# EAGLE design rapidshark-half-assed-half-h-bridge-mk-1.1 (EAGLE 7.5.0)
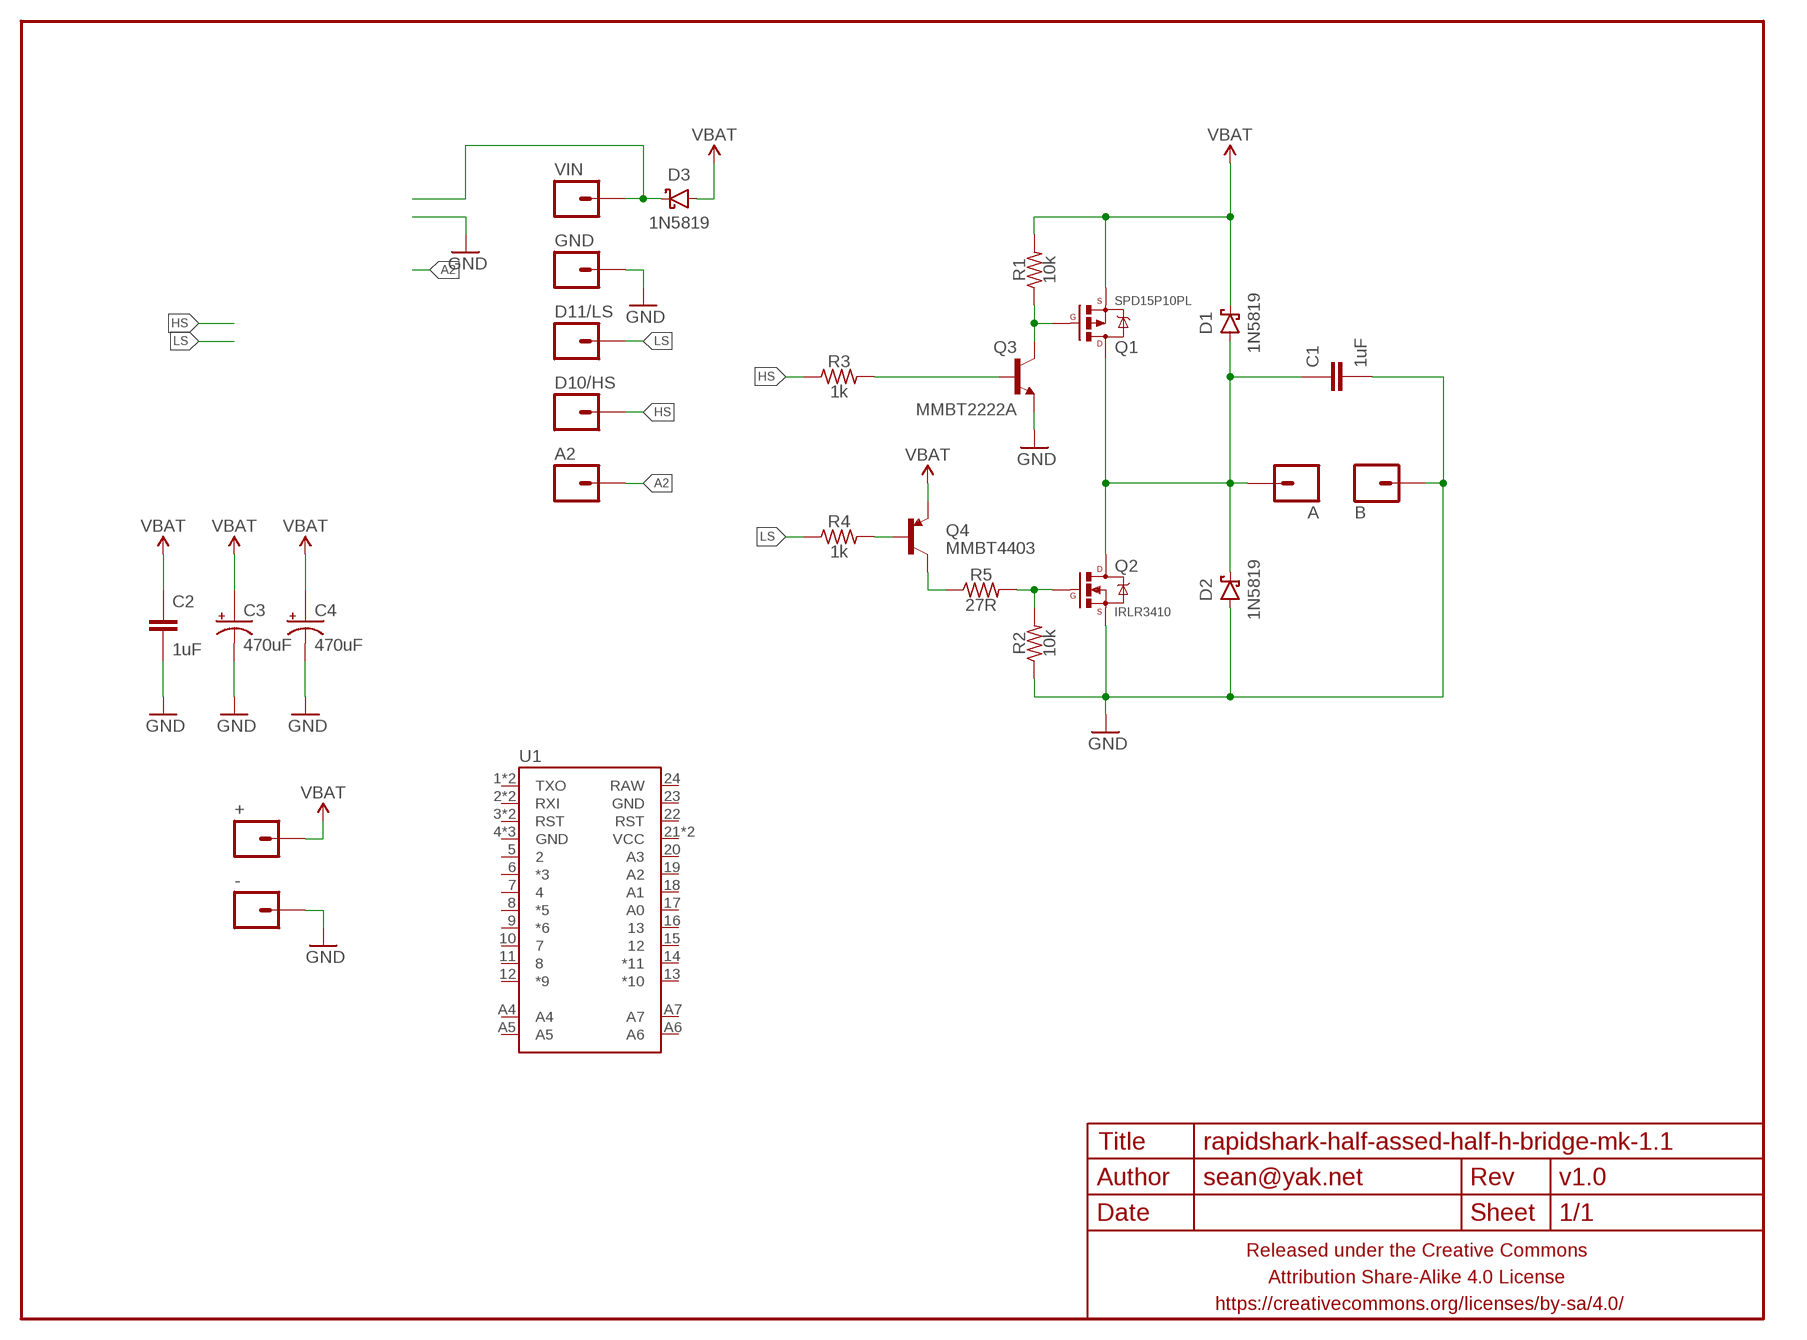
[diagram p0: schematic, sheet 1]

## Parts
+  M01PTH-1.4MM  [1X01-1.4MM-CIR]
-  M01PTH-1.4MM  [1X01-1.4MM-CIR]
A  M01PTH-1.4MM  [1X01-1.4MM-CIR]
A2  M01PTH  [1X01]
B  M01PTH-1.4MM  [1X01-1.4MM-CIR]
C1  1uF  CAPACITOR-CERAMICC0603-TIGHTER  [C0603-TIGHTER]
C2  1uF  CAPACITOR-CERAMICC0603-TIGHTER  [C0603-TIGHTER]
C3  470uF  CAPACITOR-POLARIZEDE5-10.5  [E5-10,5]
C4  470uF  CAPACITOR-POLARIZEDE5-10.5  [E5-10,5]
D1  1N5819  DIODE-SCHOTTKYSMA  [SMA-DIODE-SCHOTTKY]
D2  1N5819  DIODE-SCHOTTKYSMA  [SMA-DIODE-SCHOTTKY]
D3  1N5819  DIODE-SCHOTTKYSOD323  [SOD323-SCHOTTKY]
D10/HS  M01PTH  [1X01]
D11/LS  M01PTH  [1X01]
FRAME1  FRAME-LETTERNO_PACKAGE  [DUMMY]
GND  M01PTH  [1X01]
Q1  SPD15P10PL  MOSFET-PCHANNELDPAK  [DPAK]
Q2  IRLR3410  MOSFET-NCHANNELFDD8780  [DPAK]
Q3  MMBT2222A  TRANSISTOR_NPNMMBT2222A  [SOT23]
Q4  MMBT4403  TRANSISTOR_PNPMMBT4403  [SOT23]
R1  10k  RESISTORR0603-TIGHTER  [R0603-TIGHTER]
R2  10k  RESISTORR0603-TIGHTER  [R0603-TIGHTER]
R3  1k  RESISTORR0603-TIGHTER  [R0603-TIGHTER]
R4  1k  RESISTORR0603-TIGHTER  [R0603-TIGHTER]
R5  27R  RESISTORR0603-TIGHTER  [R0603-TIGHTER]
U1  ARDUINO_PRO_MINIMINE  [ARDUINO_PRO_MINI_MINE]
VIN  M01PTH  [1X01]

## Nets
A: A.P$1 C1.1 D1.A D2.C Q1.4(D) Q2.4(D)
GND: -.P$1 B.P$1 C1.2 C2.2 C3.- C4.- D2.A GND.1 Q2.3(S) Q3.2(E) R2.1
HS: D10/HS.1 R3.1
LS: D11/LS.1 R4.1
N$1: Q1.1(G) Q3.3(C) R1.1
N$2: Q2.1(G) R2.2 R5.2
N$3: Q3.1(B) R3.2
N$4: Q4.1(B) R4.2
N$5: Q4.3(C) R5.1
N$6: D3.C VIN.1
VBAT: +.P$1 C2.1 C3.+ C4.+ D1.C D3.A Q1.3(S) Q4.2(E) R1.2
Unconnected: A2.1 U1.1(TXO) U1.2(RXI) U1.3(RST) U1.4(GND) U1.5 U1.6(*3) U1.7 U1.8(*5) U1.9(*6) U1.10 U1.11 U1.12(*9) U1.13(*10) U1.14(*11) U1.15 U1.16 U1.17(A0) U1.18(A1) U1.19(A2) U1.20(A3) U1.21(VCC) U1.22(RST) U1.23(GND) U1.24(RAW) U1.A4 U1.A5 U1.A6 U1.A7 U1.BLK(GND) U1.GND U1.GRN(RST) U1.RXI U1.TXO U1.VCC

## Library data of the parts
+ - A A2 B D10/HS D11/LS GND VIN = a_parts:M01: Header 1 Standard 1-pin 0.1" header. Use with straight break away headers (SKU : PRT-00116), right angle break away headers (PRT-00553), swiss pins (PRT-00743), machine pins (PRT-00117), and female headers (PRT-00115).
C1 C2 = a_parts:CAPACITOR-CERAMIC: CAPACITOR, European symbol
C3 C4 = a_parts:CAPACITOR-POLARIZED: POLARIZED CAPACITOR, American symbol
D1-D3 = a_parts:DIODE-SCHOTTKY: Schottky diodes in SFE's production catalog BAT20J 1A 23V 0.62Vf RB751 120mA 40V 0.37Vf PMEG4005EJ 0.5A 40V 0.42Vf MBRA140 1A 40V 0.5Vf B340A 3A 40V SMA
FRAME1 = A_butts:FRAME-LETTER: Schematic Frame Standard 8.5x11 US Letter frame; DESIGNER: sean@yak.net; VERSION: v1.0
Q1 = a_parts:MOSFET-PCHANNEL: Generic PMOSFET IRLML2244 - TRANS-11153 (SOT-23 -20V -4.3A) (1.Gate 2.Source 3.Drain) FQP27P06 - COM-10349 <http://www.sparkfun.com/products/10349> (TO-220 -60V -27A) (1.Gate 2.Source 3.Drain)
Q2 = a_parts:MOSFET-NCHANNEL: Common NMOSFET Parts MFG P/N Store ID Prod ID FDD8780 TRANS-09984 SI7820DN TRANS-11055 FDS6630A IC-08089 2N7002PW TRANS-11151 FQP30N06L COM-10213 TRANS-10060 BSS123LT1G TRANS-08345 BSS138 TRANS-00830 BS170 2N7000; PROD_ID: TRANS-09984
Q3 = a_parts:TRANSISTOR_NPN: Generic NPN BJT MMBT2222A - TRANS-08049 (SOT-23, 1A 40V) MPSA42 - TRANS-09116 (SOT-23, 500mA 300V) MMBT5088LT1G - TRANS-11160 (SOT-23, 50 mA 30V) BC547 - COM-08928 <http://www.sparkfun.com/products/8928> (TO-92 45V 100mA) (1.Collector 2.Base 3.Emitter) 2N3904 - COM-00521 <http://www.sparkfun.com/products/521> (TO-92 40V 200mA) (1.Emitter 2.Base 3.Collector) P2N2222A - COM-12852 <http://www.sparkfun.com/products/12852> (TO-92 40V 600mA) (1.Collector 2.Base 3.Emitter)
Q4 = a_parts:TRANSISTOR_PNP: Generic PNP BJT Double check pinouts against datasheets- not all devices are the same! MMBT3906 - 40V 200mA SOT-23 (TRANS-08052) MMBT4403 - 40V 600mA SOT-23 (TRANS-09245); PROD_ID: TRANS-09245
R1-R5 = a_parts:RESISTOR: RESISTOR, American symbol
U1 = a_parts:ARDUINO_PRO_MINI

## Board
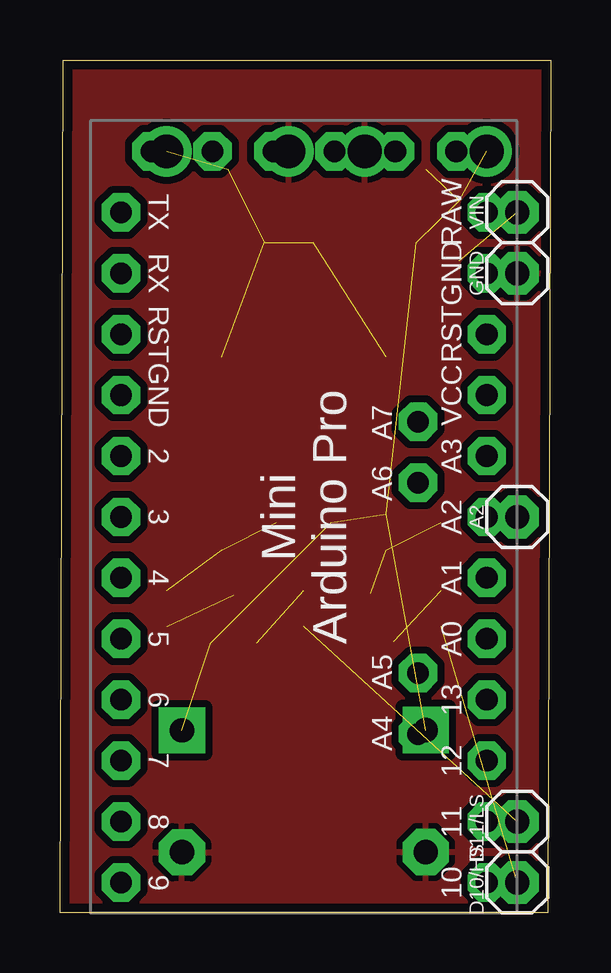
[diagram p1: board, top side]
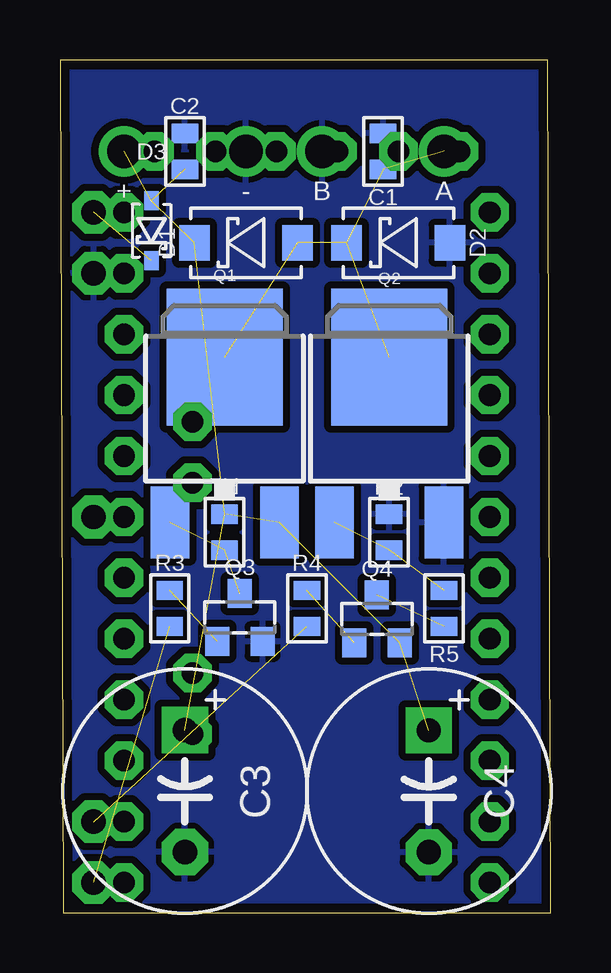
[diagram p2: board, bottom side, seen from below]

Size 20.45 x 35.56 mm. Coordinates in mm from the lower left corner, seen from the top.
Outline: 20.32,0 0,0 0.13,35.56 20.45,35.56 20.32,0
Copper layers (1*16): Top 0.0356mm / dielectric 1.5011mm / Bottom 0.0356mm
Design rules "LaenPCBOrder_2": minimum track width 6mil, minimum drill 13mil, track to track 6mil, track to pad 6mil, pad to pad 6mil, via to via 6mil, smd to smd 6mil, copper to edge 15mil, drill to drill 6mil, minimum pad ring 7mil, minimum via ring 7mil, stop-mask expansion 3mil, vias tented up to drill 20mil, thermal gap 10mil

### Footprints (pad centres in the part's own frame; a part is rotated, then mirrored left to right if it is on the bottom)
1X01-1.4MM-CIR = drill 1.4 pad 2.1: P$1 0,0
1X01 = drill 1.016 pad 1.778 octagon: 1 0,0
C0603-TIGHTER = smd 0.8 x 1.1: 1 -0.75,0; 2 0.75,0
E5-10,5 = drill 1.016 pad 1.93 square: + -2.54,0 | drill 1.016 pad 1.93 octagon: - 2.54,0
SMA-DIODE-SCHOTTKY = smd 1.27 x 1.47: A -2.15,0; C 2.15,0
SOD323-SCHOTTKY = smd 0.8 x 0.6: A -1.25,0; C 1.25,0
DPAK = smd 1.6 x 3: 1 -2.28,-5.31; 3 2.28,-5.31 | smd 4.826 x 5.715: 4 0,1.588
SOT23 = smd 1 x 1.2: 1 -0.95,-1; 2 0.95,-1; 3 0,1
R0603-TIGHTER = smd 0.8 x 1.1: 1 -0.75,0; 2 0.75,0
ARDUINO_PRO_MINI_MINE = drill 0.9 pad 1.6 octagon: 1 -7.62,12.7; 2 -7.62,10.16; 3 -7.62,7.62; 4 -7.62,5.08; 5 -7.62,2.54; 6 -7.62,0; 7 -7.62,-2.54; 8 -7.62,-5.08; 9 -7.62,-7.62; 10 -7.62,-10.16; 11 -7.62,-12.7; 12 -7.62,-15.24; 13 7.62,-15.24; 14 7.62,-12.7; 15 7.62,-10.16; 16 7.62,-7.62; 17 7.62,-5.08; 18 7.62,-2.54; 19 7.62,0; 20 7.62,2.54; 21 7.62,5.08; 22 7.62,7.62; 23 7.62,10.16; 24 7.62,12.7; A4 4.763,1.429; A5 4.763,3.969; A6 4.763,-9.049; A7 4.763,-6.509; BLK -6.35,15.24; GND -3.81,15.24; GRN 6.35,15.24; RXI 1.27,15.24; TXO 3.81,15.24; VCC -1.27,15.24

### Placement (x,y rotation side)
+  17.78,31.75 0 bottom
-  12.7,31.75 0 bottom
A  4.45,31.75 0 bottom
A2  19.05,16.51 90 top
B  9.53,31.75 0 bottom
C1  6.99,31.75 90 bottom
C2  15.24,31.75 90 bottom
C3  15.24,5.08 270 bottom
C4  5.08,5.07 270 bottom
D1  12.7,27.94 180 bottom
D2  6.35,27.94 180 bottom
D3  16.64,28.45 270 bottom
D10/HS  19.05,1.27 270 top
D11/LS  19.05,3.81 270 top
FRAME1  0,0 0 bottom
GND  19.05,26.67 90 top
Q1  13.59,21.59 0 bottom
Q2  6.73,21.59 0 bottom
Q3  12.95,12.32 0 bottom
Q4  7.24,12.26 0 bottom
R1  13.59,15.88 90 bottom
R2  6.73,15.88 270 bottom
R3  15.88,12.7 90 bottom
R4  10.16,12.7 90 bottom
R5  4.45,12.7 90 bottom
U1  10.16,16.51 0 top
U$1  [COW_SMALL_METAL_NOTEXT]  36.83,22.86 0 bottom  (outside the outline)
U$2  [CC-BY-SA-4.0-NO-URL]  36.83,15.88 0 bottom  (outside the outline)
U$3  [OSHWLOGO_TINY_SILKONLY]  41.27,15.88 0 top  (outside the outline)
VIN  19.05,29.21 90 top

### Tracks (layer width: path | path; a pad name or v marks a point on that pad's centre or on a via)
A  (5 unrouted)
GND
  pour Bottom (isolate 0.305, rank 5): 20.45,35.56 20.32,0 0,0 0.13,35.56
  pour Top (isolate 0.305, rank 5): 20.45,35.56 20.32,0 0,0 0.13,35.56
HS  (1 unrouted)
LS  (1 unrouted)
N$1  (2 unrouted)
N$2  (2 unrouted)
N$3  (1 unrouted)
N$4  (1 unrouted)
N$5  (1 unrouted)
N$6  (1 unrouted)
VBAT  (8 unrouted)

### Text on the board
Top: v1.0
Bottom: v1.0
tPlace: v1.0
bPlace: Half-Assed / Half Bridge | by schizobovine / <sean@yak.net> | v1.0